# EAGLE schematic Wifi Gas Sensor (EAGLE 8.6.1)
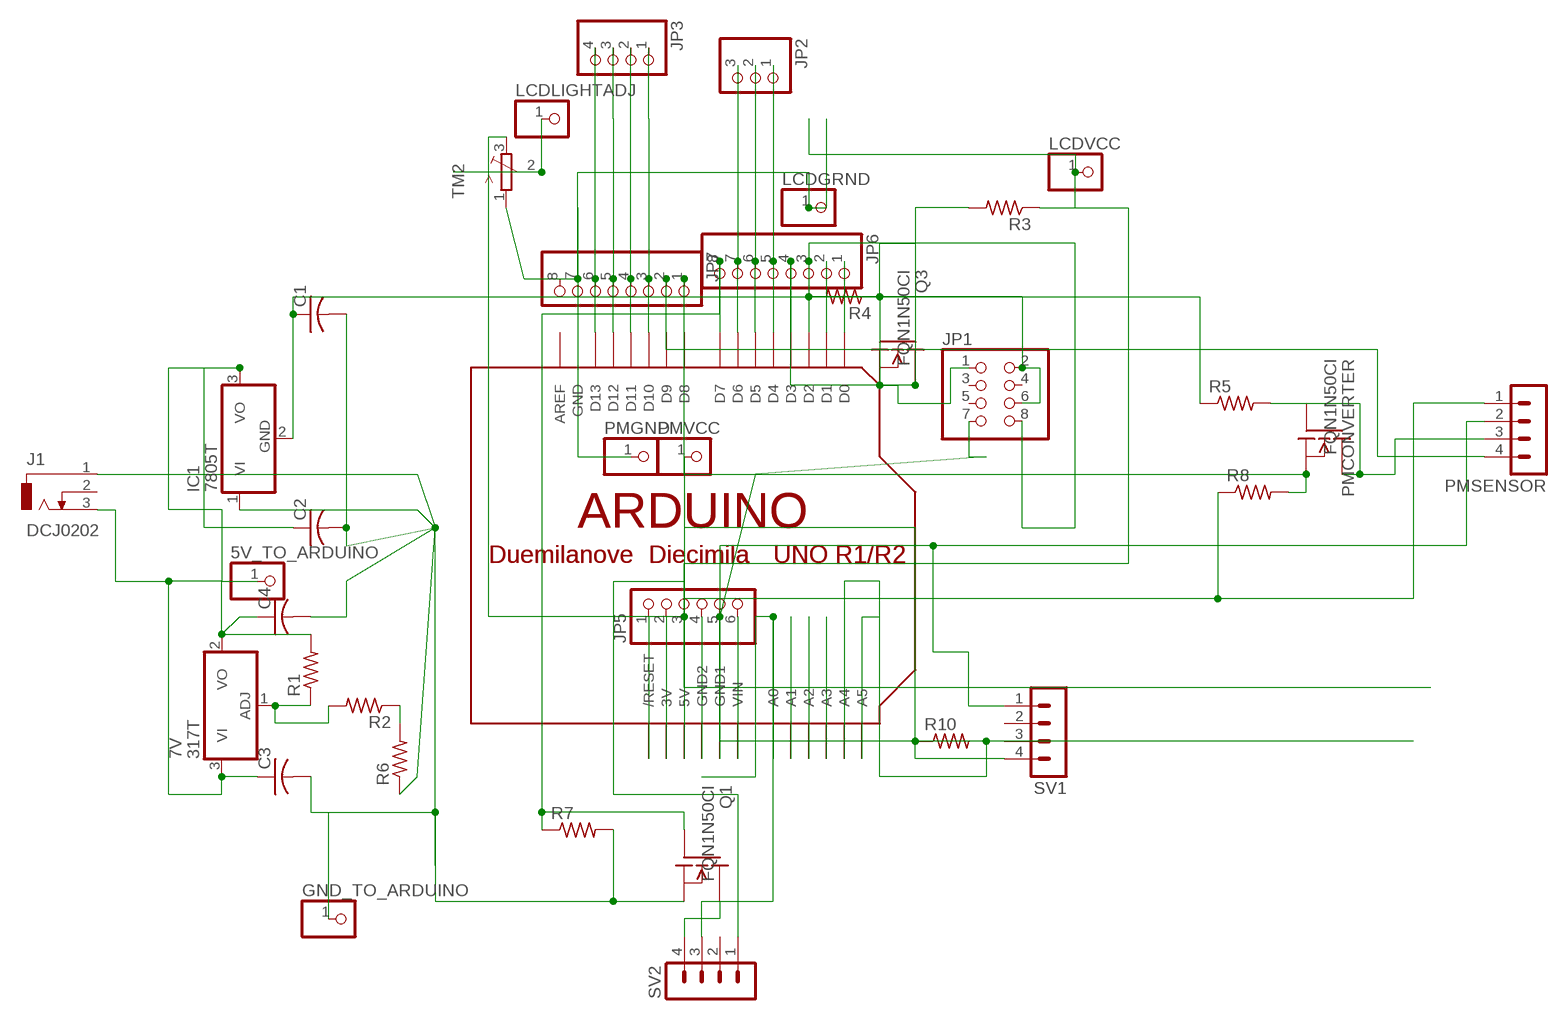
[diagram p0: schematic, sheet 1]

## Parts
5V_TO_ARDUINO  PINHD-1X1  [1X01]
7V  317T  [TO220H]
C1  C-US025-024X044  [C025-024X044]
C2  C-US025-024X044  [C025-024X044]
C3  C-US025-024X044  [C025-024X044]
C4  C-US025-024X044  [C025-024X044]
GND_TO_ARDUINO  PINHD-1X1  [1X01]
IC1  7805T  [TO220H]
J1  DCJ0202  [DCJ0202]
JP1  PINHD-2X4  [2X04]
JP2  PINHD-1X3  [1X03]
JP3  PINHD-1X4  [1X04]
JP5  PINHD-1X6B  [1X06-BIG]
JP6  PINHD-1X8BIG  [1X08-BIG]
JP7  PINHD-1X8BIG  [1X08-BIG]
LCDGRND  PINHD-1X1  [1X01]
LCDLIGHTADJ  PINHD-1X1  [1X01]
LCDVCC  PINHD-1X1  [1X01]
PMCONVERTER  FQN1N50CI  [TO92-INLINE]
PMGND  PINHD-1X1  [1X01]
PMSENSOR  MA04-1  [MA04-1]
PMVCC  PINHD-1X1  [1X01]
Q1  FQN1N50CI  [TO92-INLINE]
Q3  FQN1N50CI  [TO92-INLINE]
R1  R-US_0204/2V  [0204V]
R2  R-US_0204/2V  [0204V]
R3  R-US_0207/5V  [0207/5V]
R4  R-US_0204/2V  [0204V]
R5  R-US_0207/5V  [0207/5V]
R6  R-US_0204/2V  [0204V]
R7  R-US_0207/2V  [0207/2V]
R8  R-US_0204/2V  [0204V]
R10  R-US_0207/2V  [0207/2V]
SV1  MA04-1  [MA04-1]
SV2  MA04-1  [MA04-1]
TM2  TRIMPOT3386  [TRIM-3386]
U$2  ADAFRUITUSER_ARDUINO-BPLACE  [ADAFRUITUSER_ARDUINO-BPLACE]

## Nets
GND_TO_ARDUINO: C1.2 C2.2 C3.2 C4.2 GND_TO_ARDUINO.1 IC1.1(VI) J1.1 Q1.3(S) R6.1 R7.2
N$1: 5V_TO_ARDUINO.1 7V.2(VO) C4.1 R1.2
N$2: 7V.1(ADJ) R1.1 R2.2
N$3: U$2.A5
N$4: JP2.1 JP6.5 U$2.D4
N$5: JP7.2 PMSENSOR.4 U$2.D9
N$6: JP6.4 Q3.1(D) R3.2 U$2.D3
N$7: JP2.2 JP6.6 U$2.D5
N$8: JP2.3 JP6.7 U$2.D6
N$9: JP3.4 JP7.6 U$2.D13
N$10: JP3.3 JP7.5 U$2.D12
N$11: JP3.2 JP7.4 U$2.D11
N$12: JP3.1 JP7.3 U$2.D10
N$13: SV2.3 U$2.A0
N$14: Q1.1(D) SV2.4
N$15: JP5.4 U$2.GND2
N$16: JP7.1 PMCONVERTER.3(S) R8.2 U$2.D8
N$17: JP1.7 JP5.5 PMSENSOR.2 SV1.1 U$2.GND1
N$18: R2.1 R6.2
N$19: 7V.3(VI) C2.1 C3.1 IC1.3(VO) J1.3
N$20: JP6.8 Q1.2(G) R7.1 U$2.D7
N$21: JP5.3 LCDVCC.1 PMSENSOR.1 PMVCC.1 R3.1 R8.1 R10.1 SV1.4 SV2.1 TM2.3(E) U$2.5V
N$22: U$2.A3
N$23: U$2.A2
N$24: U$2.A1
N$25: JP5.6 U$2.VIN
N$26: JP1.8 JP6.3 U$2.D2
N$27: C1.1 IC1.2(GND) JP1.2 JP1.6 R4.2 R5.1
N$28: JP5.2 U$2.3V
N$29: JP5.1 U$2.RESET(/RESET)
N$30: JP6.1 U$2.D0
N$31: JP6.2 U$2.D1
N$32: JP7.7 LCDGRND.1 PMGND.1 TM2.1(A) U$2.GND
N$34: LCDLIGHTADJ.1 TM2.2(S)
N$35: R10.2 SV1.3 U$2.A4
N$36: JP1.1 Q3.2(G) Q3.3(S) R4.1
N$37: PMCONVERTER.1(D) PMCONVERTER.2(G) PMSENSOR.3 R5.2
Unconnected: J1.2 JP1.3 JP1.4 JP1.5 JP7.8 SV1.2 SV2.2 U$2.AREF

## Library data of the parts
5V_TO_ARDUINO GND_TO_ARDUINO LCDGRND LCDLIGHTADJ LCDVCC PMGND PMVCC = pinheadUSER:PINHD-1X1: PIN HEADER
7V = linear:*317: Positive VOLTAGE REGULATOR
C1-C4 = adafruitUSER:C-US: CAPACITOR, American symbol
IC1 = adafruit:78*: Positive VOLTAGE REGULATOR Added bigger pads to the TO-92 package
J1 = con-jack:DCJ0202: DC POWER JACK Source: DCJ0202.pdf; OC_FARNELL: unknown; OC_NEWARK: unknown
JP1 = pinheadUSER:PINHD-2X4: PIN HEADER
JP2 = pinhead:PINHD-1X3: PIN HEADER
JP3 = pinhead:PINHD-1X4: PIN HEADER
JP5 = adafruitUSER:PINHD-1X6: PIN HEADER
JP6 JP7 = adafruitUSER:PINHD-1X8: PIN HEADER
PMCONVERTER Q1 Q3 = adafruitUSER:FQN1N50C: N-Channel Enhancement MOSFET 500V, 0.4A, 6.0 Ohm
PMSENSOR SV1 SV2 = con-lstb:MA04-1: PIN HEADER; OC_FARNELL: unknown; OC_NEWARK: unknown
R1 R2 R4-R8 R10 = resistorUSER:R-US_: RESISTOR, American symbol
R3 = adafruitUSER:R-US_: RESISTOR, American symbol
TM2 = adafruit:TRIMPOT: SMT trimmer potentiometer part number TC33X http://www.ladyada.net/library/eagle
U$2 = Wifi Gas Sensor:ADAFRUITUSER_ARDUINO: Arduino Diecimila/Duemilanove Make a shield with ease, this package has all the named pins as well as the two mounting drill holes and an outline of the USB and DC power connector. The outline is on the DIMENSION layer, so if your board house uses it they will cut the outline to match. http://www.ladyada.net/library/pcb/eaglelibrary.html